# Altium schematic sheet EVL1608C-TL-00A_schematic.SchDoc
size A
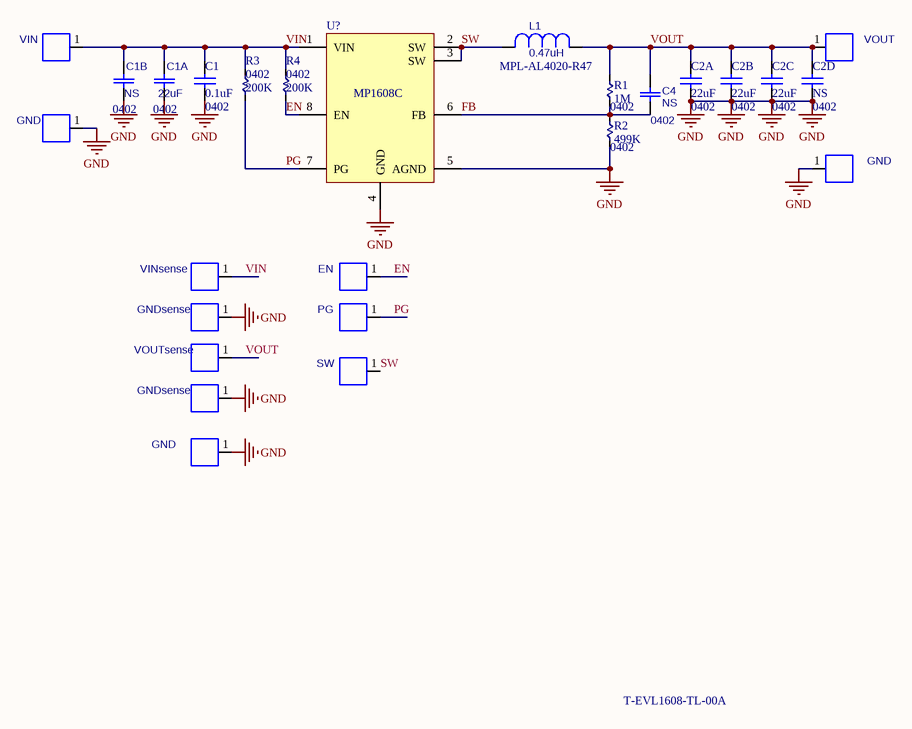
[diagram p0: EVL1608C-TL-00A_schematic.SchDoc]

## Parts
(Parts that share a designator on the sheet are numbered #1, #2 ... from top to bottom, then left to right.)
C1  value 0.1uF  Package: 0402  [CAP/0402]  (hidden comment: Cap)
C1A  value 22uF  [CAP/0402]  (hidden comment: CAP\0603)
C1B  value NS  [CAP/0402]  (hidden comment: CAP\0603)
C2A  value 22uF  Package: 0402  [CAP/0402]  (hidden comment: Cap)
C2B  value 22uF  Package: 0402  [CAP/0402]  (hidden comment: Cap)
C2C  value 22uF  Package: 0402  [CAP/0402]  (hidden comment: Cap)
C2D  value NS  Package: 0402  [CAP/0402]  (hidden comment: Cap)
C4  value NS  Package: 0402  [CAP/0402]
EN  CONN/1MM  [TP/1MM]  (value not drawn)
GND#1  CONN/1MM  [TP/2MM]  (value not drawn)
GND#2  CONN/1MM  [TP/2MM]  (value not drawn)
GND#3  CONN/1MM  [TP/1MM]  (value not drawn)
GNDsense#1  CONN/1MM  [TP/1MM]  (value not drawn)
GNDsense#2  CONN/1MM  [TP/1MM]  (value not drawn)
L1  value 0.47uH  [MPL-AL4020-R47]  (hidden comment: COILCRAFT/LPO2506IB-682)
PG  CONN/1MM  [TP/1MM]  (value not drawn)
R1  value 1M  Package: 0402  [RES/0402]  (hidden comment: RC(0603_50V0805_150V1206_200V2512_200V)
R2  value 499K  Package: 0402  [RES/0402]  (hidden comment: RC(0603_50V0805_150V1206_200V2512_200V)
R3  value 200K  Package: 0402  [RES/0402]  (hidden comment: RC(0603_50V0805_150V1206_200V2512_200V)
R4  value 200K  Package: 0402  [RES/0402]  (hidden comment: RC(0603_50V0805_150V1206_200V2512_200V)
SW  CONN/1MM  [TP/1MM]  (value not drawn)
U?  MP1608C  [SOT583]
VIN  CONN/2MM  [TP/2MM]  (value not drawn)
VINsense  CONN/1MM  [TP/1MM]  (value not drawn)
VOUT  CONN/2MM  [TP/2MM]  (value not drawn)
VOUTsense  CONN/1MM  [TP/1MM]  (value not drawn)

## Nets
GND: C1.1 C1A.1 C1B.1 C2A.1 C2B.1 C2C.1 C2D.1 GND#1.1 GND#2.1 GND#3.1 GNDsense#1.1 GNDsense#2.1 R2.1 U?.4(GND) U?.5(AGND)
EN: EN.1 R4.2 U?.8(EN)
FB: C4.2 R1.1 R2.2 U?.6(FB)
PG: PG.1 R3.2 U?.7(PG)
SW: L1.1 SW.1 U?.2(SW) U?.3(SW)
VIN: C1.2 C1A.2 C1B.2 R3.1 R4.1 U?.1(VIN) VIN.1 VINsense.1
VOUT: C2A.2 C2B.2 C2C.2 C2D.2 C4.1 L1.2 R1.2 VOUT.1 VOUTsense.1

## Notes on the sheet
- T-EVL1608-TL-00A
- (in symbol CAP0603) 0402
- (in symbol TOKO106C) MPL-AL4020-R47

## Library data of the parts
C1 C2A C2B C2C C2D = Cap: 50V Ceramic Capacitor
C1A C1B = CAP0603
C4 = CAP/0402: {Description}; Manufacturer: {Manufacturer}; Manufacturer P/N: {Manufacturer P/N}
EN GND#1-GND#3 GNDsense#1 GNDsense#2 PG SW VIN VINsense VOUT VOUTsense = CONN/2MM: {Description}; Manufacturer P/N: {Manufacturer P/N}; Manufacturer: {Manufacturer}; Package: {Package}; Value: *
L1 = TOKO106C
R1-R4 = SMR: Film resistor, 1%; Manufacturer: YAGEO